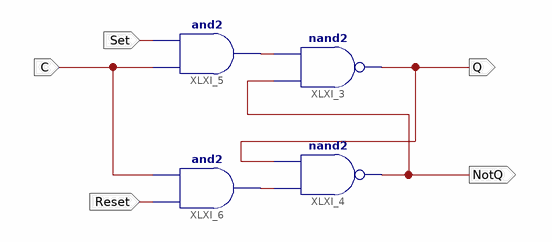
[diagram p0: schematic sheet 1]
// Xilinx ISE schematic SR_Latch_Ctrl.sch (kintex7) as structural Verilog: 4 symbols, 5 ports
module SR_Latch_Ctrl (
  input  C,
  input  Set,
  input  Reset,
  output Q,
  output NotQ
);

  wire XLXN_6, XLXN_7;

  nand XLXI_3 (Q, NotQ, XLXN_6);
  nand XLXI_4 (NotQ, XLXN_7, Q);
  and XLXI_5 (XLXN_6, C, Set);
  and XLXI_6 (XLXN_7, Reset, C);
endmodule
